# Altium schematic sheet Digital_Output_LED_Monitor.SchDoc: TTL IO LED Monitor
size Tabloid; Date: 05/10/2023; Engineer: Terry D. Schevker; Revision: 1.0; SheetNumber: 3; SheetTotal: 3
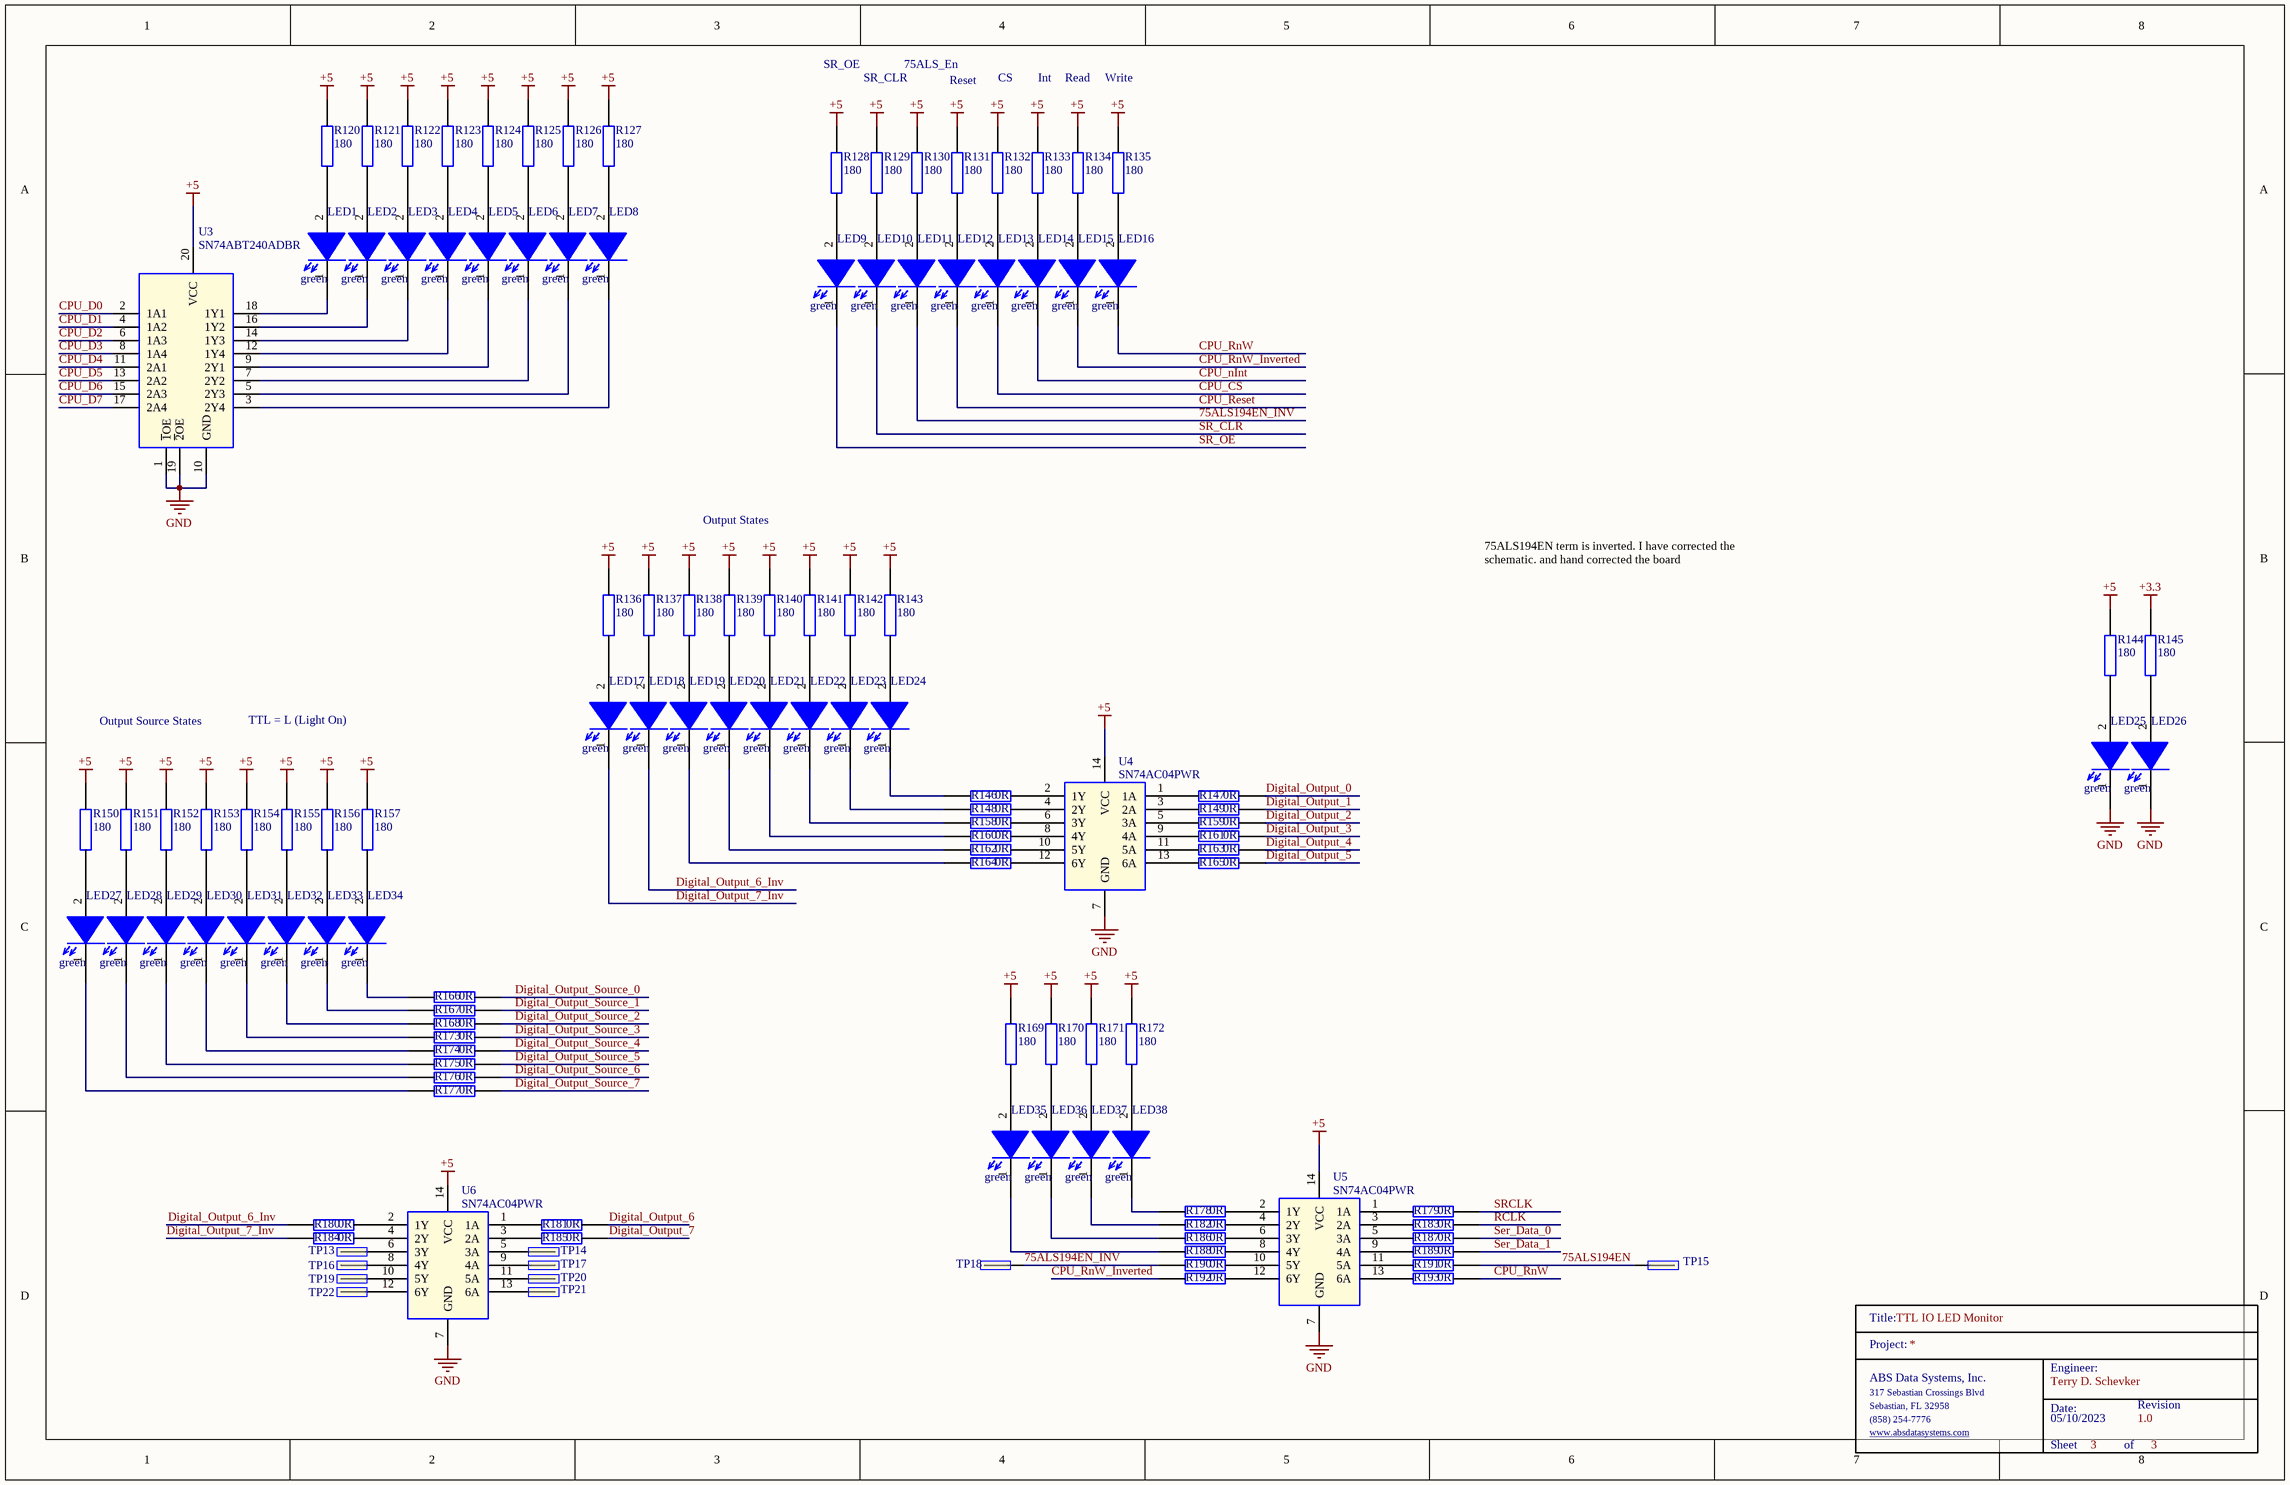
[diagram p0: Digital_Output_LED_Monitor.SchDoc]

## Parts
LED1  green  [0603_Diode]
LED2  green  [0603_Diode]
LED3  green  [0603_Diode]
LED4  green  [0603_Diode]
LED5  green  [0603_Diode]
LED6  green  [0603_Diode]
LED7  green  [0603_Diode]
LED8  green  [0603_Diode]
LED9  green  [0603_Diode]
LED10  green  [0603_Diode]
LED11  green  [0603_Diode]
LED12  green  [0603_Diode]
LED13  green  [0603_Diode]
LED14  green  [0603_Diode]
LED15  green  [0603_Diode]
LED16  green  [0603_Diode]
LED17  green  [0603_Diode]
LED18  green  [0603_Diode]
LED19  green  [0603_Diode]
LED20  green  [0603_Diode]
LED21  green  [0603_Diode]
LED22  green  [0603_Diode]
LED23  green  [0603_Diode]
LED24  green  [0603_Diode]
LED25  green  [0603_Diode]
LED26  green  [0603_Diode]
LED27  green  [0603_Diode]
LED28  green  [0603_Diode]
LED29  green  [0603_Diode]
LED30  green  [0603_Diode]
LED31  green  [0603_Diode]
LED32  green  [0603_Diode]
LED33  green  [0603_Diode]
LED34  green  [0603_Diode]
LED35  green  [0603_Diode]
LED36  green  [0603_Diode]
LED37  green  [0603_Diode]
LED38  green  [0603_Diode]
R120  180  [0603]
R121  180  [0603]
R122  180  [0603]
R123  180  [0603]
R124  180  [0603]
R125  180  [0603]
R126  180  [0603]
R127  180  [0603]
R128  180  [0603]
R129  180  [0603]
R130  180  [0603]
R131  180  [0603]
R132  180  [0603]
R133  180  [0603]
R134  180  [0603]
R135  180  [0603]
R136  180  [0603]
R137  180  [0603]
R138  180  [0603]
R139  180  [0603]
R140  180  [0603]
R141  180  [0603]
R142  180  [0603]
R143  180  [0603]
R144  180  [0603]
R145  180  [0603]
R146  0R  [0603]
R147  0R  [0603]
R148  0R  [0603]
R149  0R  [0603]
R150  180  [0603]
R151  180  [0603]
R152  180  [0603]
R153  180  [0603]
R154  180  [0603]
R155  180  [0603]
R156  180  [0603]
R157  180  [0603]
R158  0R  [0603]
R159  0R  [0603]
R160  0R  [0603]
R161  0R  [0603]
R162  0R  [0603]
R163  0R  [0603]
R164  0R  [0603]
R165  0R  [0603]
R166  0R  [0603]
R167  0R  [0603]
R168  0R  [0603]
R169  180  [0603]
R170  180  [0603]
R171  180  [0603]
R172  180  [0603]
R173  0R  [0603]
R174  0R  [0603]
R175  0R  [0603]
R176  0R  [0603]
R177  0R  [0603]
R178  0R  [0603]
R179  0R  [0603]
R180  0R  [0603]
R181  0R  [0603]
R182  0R  [0603]
R183  0R  [0603]
R184  0R  [0603]
R185  0R  [0603]
R186  0R  [0603]
R187  0R  [0603]
R188  0R  [0603]
R189  0R  [0603]
R190  0R  [0603]
R191  0R  [0603]
R192  0R  [0603]
R193  0R  [0603]
TitleBlock_2  TitleBlock  (value not drawn)  (graphical)
TP13  TP  [TP]  (value not drawn)
TP14  TP  [TP]  (value not drawn)
TP15  TP  [TP]  (value not drawn)
TP16  TP  [TP]  (value not drawn)
TP17  TP  [TP]  (value not drawn)
TP18  TP  [TP]  (value not drawn)
TP19  TP  [TP]  (value not drawn)
TP20  TP  [TP]  (value not drawn)
TP21  TP  [TP]  (value not drawn)
TP22  TP  [TP]  (value not drawn)
U3  SN74ABT240ADBR  [SOP65P780X200-20N]
U4  SN74AC04PWR  [SOP65P640X120-14N]
U5  SN74AC04PWR  [SOP65P640X120-14N]
U6  SN74AC04PWR  [SOP65P640X120-14N]

## Nets
+3.3: R145.2
+5: R120.2 R121.2 R122.2 R123.2 R124.2 R125.2 R126.2 R127.2 R128.2 R129.2 R130.2 R131.2 R132.2 R133.2 R134.2 R135.2 R136.2 R137.2 R138.2 R139.2 R140.2 R141.2 R142.2 R143.2 R144.2 R150.2 R151.2 R152.2 R153.2 R154.2 R155.2 R156.2 R157.2 R169.2 R170.2 R171.2 R172.2 U3.20(VCC) U4.14(VCC) U5.14(VCC) U6.14(VCC)
GND: LED25.1(K) LED26.1(K) U3.1(~{1}OE) U3.10(GND) U3.19(~{2}OE) U4.7(GND) U5.7(GND) U6.7(GND)
75ALS194EN: R191.2 TP15.1
75ALS194EN_INV: LED11.1(K) R190.1 TP18.1
CPU_CS: LED13.1(K)
CPU_D0: U3.2(1A1)
CPU_D1: U3.4(1A2)
CPU_D2: U3.6(1A3)
CPU_D3: U3.8(1A4)
CPU_D4: U3.11(2A1)
CPU_D5: U3.13(2A2)
CPU_D6: U3.15(2A3)
CPU_D7: U3.17(2A4)
CPU_nInt: LED14.1(K)
CPU_Reset: LED12.1(K)
CPU_RnW: LED16.1(K) R193.2
CPU_RnW_Inverted: LED15.1(K) R192.1
Digital_Output_0: R147.2
Digital_Output_1: R149.2
Digital_Output_2: R159.2
Digital_Output_3: R161.2
Digital_Output_4: R163.2
Digital_Output_5: R165.2
Digital_Output_6: R181.2
Digital_Output_6_Inv: LED18.1(K) R180.1
Digital_Output_7: R185.2
Digital_Output_7_Inv: LED17.1(K) R184.1
Digital_Output_Source_0: R166.2
Digital_Output_Source_1: R167.2
Digital_Output_Source_2: R168.2
Digital_Output_Source_3: R173.2
Digital_Output_Source_4: R174.2
Digital_Output_Source_5: R175.2
Digital_Output_Source_6: R176.2
Digital_Output_Source_7: R177.2
RCLK: R183.2
Ser_Data_0: R187.2
Ser_Data_1: R189.2
SR_CLR: LED10.1(K)
SR_OE: LED9.1(K)
SRCLK: R179.2
NetLED1_1: LED1.1(K) U3.18(1Y1)
NetLED1_2: LED1.2(A) R120.1
NetLED2_1: LED2.1(K) U3.16(1Y2)
NetLED2_2: LED2.2(A) R121.1
NetLED3_1: LED3.1(K) U3.14(1Y3)
NetLED3_2: LED3.2(A) R122.1
NetLED4_1: LED4.1(K) U3.12(1Y4)
NetLED4_2: LED4.2(A) R123.1
NetLED5_1: LED5.1(K) U3.9(2Y1)
NetLED5_2: LED5.2(A) R124.1
NetLED6_1: LED6.1(K) U3.7(2Y2)
NetLED6_2: LED6.2(A) R125.1
NetLED7_1: LED7.1(K) U3.5(2Y3)
NetLED7_2: LED7.2(A) R126.1
NetLED8_1: LED8.1(K) U3.3(2Y4)
NetLED8_2: LED8.2(A) R127.1
NetLED9_2: LED9.2(A) R128.1
NetLED10_2: LED10.2(A) R129.1
NetLED11_2: LED11.2(A) R130.1
NetLED12_2: LED12.2(A) R131.1
NetLED13_2: LED13.2(A) R132.1
NetLED14_2: LED14.2(A) R133.1
NetLED15_2: LED15.2(A) R134.1
NetLED16_2: LED16.2(A) R135.1
NetLED17_2: LED17.2(A) R136.1
NetLED18_2: LED18.2(A) R137.1
NetLED19_1: LED19.1(K) R164.1
NetLED19_2: LED19.2(A) R138.1
NetLED20_1: LED20.1(K) R162.1
NetLED20_2: LED20.2(A) R139.1
NetLED21_1: LED21.1(K) R160.1
NetLED21_2: LED21.2(A) R140.1
NetLED22_1: LED22.1(K) R158.1
NetLED22_2: LED22.2(A) R141.1
NetLED23_1: LED23.1(K) R148.1
NetLED23_2: LED23.2(A) R142.1
NetLED24_1: LED24.1(K) R146.1
NetLED24_2: LED24.2(A) R143.1
NetLED25_2: LED25.2(A) R144.1
NetLED26_2: LED26.2(A) R145.1
NetLED27_1: LED27.1(K) R177.1
NetLED27_2: LED27.2(A) R150.1
NetLED28_1: LED28.1(K) R176.1
NetLED28_2: LED28.2(A) R151.1
NetLED29_1: LED29.1(K) R175.1
NetLED29_2: LED29.2(A) R152.1
NetLED30_1: LED30.1(K) R174.1
NetLED30_2: LED30.2(A) R153.1
NetLED31_1: LED31.1(K) R173.1
NetLED31_2: LED31.2(A) R154.1
NetLED32_1: LED32.1(K) R168.1
NetLED32_2: LED32.2(A) R155.1
NetLED33_1: LED33.1(K) R167.1
NetLED33_2: LED33.2(A) R156.1
NetLED34_1: LED34.1(K) R166.1
NetLED34_2: LED34.2(A) R157.1
NetLED35_1: LED35.1(K) R188.1
NetLED35_2: LED35.2(A) R169.1
NetLED36_1: LED36.1(K) R186.1
NetLED36_2: LED36.2(A) R170.1
NetLED37_1: LED37.1(K) R182.1
NetLED37_2: LED37.2(A) R171.1
NetLED38_1: LED38.1(K) R178.1
NetLED38_2: LED38.2(A) R172.1
NetR146_2: R146.2 U4.2(1Y)
NetR147_1: R147.1 U4.1(1A)
NetR148_2: R148.2 U4.4(2Y)
NetR149_1: R149.1 U4.3(2A)
NetR158_2: R158.2 U4.6(3Y)
NetR159_1: R159.1 U4.5(3A)
NetR160_2: R160.2 U4.8(4Y)
NetR161_1: R161.1 U4.9(4A)
NetR162_2: R162.2 U4.10(5Y)
NetR163_1: R163.1 U4.11(5A)
NetR164_2: R164.2 U4.12(6Y)
NetR165_1: R165.1 U4.13(6A)
NetR178_2: R178.2 U5.2(1Y)
NetR179_1: R179.1 U5.1(1A)
NetR180_2: R180.2 U6.2(1Y)
NetR181_1: R181.1 U6.1(1A)
NetR182_2: R182.2 U5.4(2Y)
NetR183_1: R183.1 U5.3(2A)
NetR184_2: R184.2 U6.4(2Y)
NetR185_1: R185.1 U6.3(2A)
NetR186_2: R186.2 U5.6(3Y)
NetR187_1: R187.1 U5.5(3A)
NetR188_2: R188.2 U5.8(4Y)
NetR189_1: R189.1 U5.9(4A)
NetR190_2: R190.2 U5.10(5Y)
NetR191_1: R191.1 U5.11(5A)
NetR192_2: R192.2 U5.12(6Y)
NetR193_1: R193.1 U5.13(6A)
NetTP13_1: TP13.1 U6.6(3Y)
NetTP14_1: TP14.1 U6.5(3A)
NetTP16_1: TP16.1 U6.8(4Y)
NetTP17_1: TP17.1 U6.9(4A)
NetTP19_1: TP19.1 U6.10(5Y)
NetTP20_1: TP20.1 U6.11(5A)
NetTP21_1: TP21.1 U6.13(6A)
NetTP22_1: TP22.1 U6.12(6Y)

## Notes on the sheet
- SR_OE
- SR_CLR
- 75ALS_En
- Reset
- CS
- Int
- Read
- Write
- Output States
- 75ALS194EN term is inverted. I have corrected the schematic. and hand corrected the board
- Output Source States
- TTL = L (Light On)
- (in symbol TitleBlock) Title:; Project:; Engineer:; ABS Data Systems, Inc.; 317 Sebastian Crossings Blvd; Sebastian, FL 32958; Date:; Revision; (858) 254-7776; www.absdatasystems.com; Sheet; of

## Library data of the parts
LED1-LED38 = 150060GS75000: Wurth Elektronik 0603 green; Manufacturer: Wurth Electronics; Wavelength: 520nm; Viewing Angle: 140°; Lens Style: Clear,Rectangular; Luminous Intensity: 430mcd; Forward Current: 30mA; Forward Voltage: 3.2V; Test Current: 20mA; Supplier 1: Digi-Key; Manufacturer Part Number: 150060GS75000; RoHS: Yes; Category: LEDs; Stock 1: 71509; Pricing 1: 1=0.14000, 50=0.13300, 100=0.11400, 500=0.09900 (USD); Mount: Surface Mount; Case/Package: 0603; Color: Green; Case Code (Metric): 1608; Case Code (Imperial): 0603; Min Operating Temperature: -40°C; Max Operating Temperature: 85°C; Package Quantity: 4000; Packaging: Tape and Reel; Dominant Wavelength: 520nm; Length: 1.6mm; Width: 0.8mm; Height: 0.7mm; REACH SVHC: Unknown; Lead Free: Lead Free; ComponentLink1URL: https://datasheet.ciiva.com/29562/150060gs75000-29562868.pdf?src-supplier=Digi-Key; ComponentLink1Description: https://datasheet.ciiva.com/29562/150060gs75000-29562868.pdf?src-supplier=Digi-Key; ComponentLink2URL: https://datasheet.ciiva.com/29279/759427-da-01-en-chipled-0603-w-kl-gruen-150060gs75000-29279201.pdf?src-supplier=Conrad; ComponentLink2Description: https://datasheet.ciiva.com/29279/759427-da-01-en-chipled-0603-w-kl-gruen-150060gs75000-29279201.pdf?src-supplier=Conrad; ComponentLink3URL: https://datasheet.ciiva.com/29562/150060gs75000-29562869.pdf?src-supplier=Digi-Key; ComponentLink3Description: https://datasheet.ciiva.com/29562/150060gs75000-29562869.pdf?src-supplier=Digi-Key; ComponentLink4URL: https://datasheet.ciiva.com/29562/150060gs75000-29562870.pdf?src-supplier=Digi-Key; ComponentLink4Description: https://datasheet.ciiva.com/29562/150060gs75000-29562870.pdf?src-supplier=Digi-Key
R120-R145 R150-R157 R169-R172 = RC0603FR-13180RL: YAGEO 0603 180 ohm; Manufacturer_Name: KEMET; Manufacturer_Part_Number: RC0603JR-070RL; Geometry.Height: 0.55mm; Mouser Part Number: 603-RC0603JR-070RL; Mouser Price/Stock: https://www.mouser.co.uk/ProductDetail/YAGEO/RC0603JR-070RL?qs=2cAdsCoAWRGWyPcuXgGiXQ%3D%3D; Datasheet Link: https://datasheet.datasheetarchive.com/originals/distributors/Datasheets_SAMA/902f9e387b938f871d31120f5fc1d65e.pdf
R146-R149 R158-R168 R173-R193 = RC0603JR-070RL: YAGEO 0603 0 ohm; Manufacturer_Name: KEMET; Geometry.Height: 0.55mm; Mouser Part Number: 603-RC0603JR-070RL; Mouser Price/Stock: https://www.mouser.co.uk/ProductDetail/YAGEO/RC0603JR-070RL?qs=2cAdsCoAWRGWyPcuXgGiXQ%3D%3D; Manufacturer_Part_Number: RC0603JR-070RL; Datasheet Link: https://datasheet.datasheetarchive.com/originals/distributors/Datasheets_SAMA/902f9e387b938f871d31120f5fc1d65e.pdf
TP13-TP22 = TP: Manufacturer: Samtec; Manufacturer Part Number: TST-105-01-G-D; Number of Contacts: 16; Gender: Male; Connector Type: Male Pin; Pitch: 2.54mm; Row Spacing: 0.1inch; Supplier 1: Digi-Key; RoHS: Yes; Category: Headers and Wire Housings; Stock 1: 227; Pricing 1: 1=2.85000, 10=2.73600, 100=2.28000, 500=1.93800, 1000=1.65300, 5000=1.48200 (USD); Mount: Through Hole; Contact Plating: Gold; Contact Material: Bronze; Housing Material: Polyester; Housing Color: Black; Color: Black; Min Operating Temperature: -55°C; Max Operating Temperature: 125°C; Number of Rows: 2; Termination: Solder; Packaging: Rail/Tube; Orientation: Straight; Number of Positions: 16; Length: 27.94mm; Depth: 9.27mm; Contact Mating Length: 0.25inch; REACH SVHC: No SVHC; ComponentLink1URL: https://datasheet.ciiva.com/739/tst-mkt-739845.pdf?src-supplier=Digi-Key; ComponentLink1Description: https://datasheet.ciiva.com/739/tst-mkt-739845.pdf?src-supplier=Digi-Key; ComponentLink2URL: https://datasheet.ciiva.com/10018/htst-10018510.pdf?src-supplier=Avnet; ComponentLink2Description: https://datasheet.ciiva.com/10018/htst-10018510.pdf?src-supplier=Avnet
U3 = SN74ABT240ADBR: Octal Buffers/Drivers With 3-State Outputs; Manufacturer_Name: Texas Instruments; Geometry.Height: 2mm; Mouser Part Number: 595-SN74ABT240ADBR; Mouser Price/Stock: https://www.mouser.co.uk/ProductDetail/Texas-Instruments/SN74ABT240ADBR?qs=JHHQeKcAU3Dt82k%252BVyiYdw%3D%3D; Manufacturer_Part_Number: SN74ABT240ADBR; Datasheet Link: http://www.ti.com/lit/gpn/sn74abt240a
U4-U6 = SN74AC04PWR: Hex Inverters; Manufacturer_Name: Texas Instruments; Geometry.Height: 1.2mm; Mouser Part Number: 595-SN74AC04PWR; Mouser Price/Stock: https://www.mouser.co.uk/ProductDetail/Texas-Instruments/SN74AC04PWR?qs=RZS%252BpEsUn7pRvPNqsga4SA%3D%3D; Manufacturer_Part_Number: SN74AC04PWR; Datasheet Link: http://www.ti.com/lit/gpn/sn74ac04